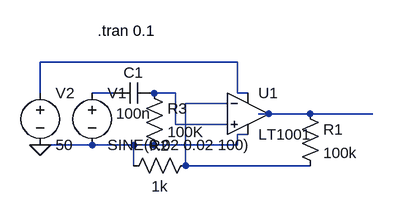
[diagram p0: schematic Draft54.asc]
Draft54.asc, the LTspice schematic file:
Version 4
SHEET 1 880 680
WIRE 528 192 224 192
WIRE 224 240 224 192
WIRE 336 240 304 240
WIRE 432 240 400 240
WIRE 528 240 528 192
WIRE 544 240 528 240
WIRE 512 256 448 256
WIRE 576 272 560 272
WIRE 640 272 576 272
WIRE 736 272 640 272
WIRE 432 288 432 240
WIRE 512 288 432 288
WIRE 544 304 528 304
WIRE 304 320 224 320
WIRE 368 320 304 320
WIRE 400 320 368 320
WIRE 528 320 528 304
WIRE 528 320 400 320
WIRE 368 352 368 320
WIRE 448 352 448 256
WIRE 640 352 448 352
FLAG 224 320 0
SYMBOL voltage 304 224 R0
SYMATTR InstName V1
SYMATTR Value SINE(0.02 0.02 100)
SYMBOL voltage 224 224 R0
SYMATTR InstName V2
SYMATTR Value 50
SYMBOL res 624 256 R0
SYMATTR InstName R1
SYMATTR Value 100k
SYMBOL res 464 336 R90
WINDOW 0 0 56 VBottom 2
WINDOW 3 32 56 VTop 2
SYMATTR InstName R2
SYMATTR Value 1k
SYMBOL Opamps/LT1001 544 208 R0
SYMATTR InstName U1
SYMBOL cap 400 224 R90
WINDOW 0 0 32 VBottom 2
WINDOW 3 32 32 VTop 2
SYMATTR InstName C1
SYMATTR Value 100n
SYMBOL res 384 224 R0
SYMATTR InstName R3
SYMATTR Value 100K
TEXT 312 144 Left 2 !.tran 0.1

The netlist it stands for:
* Draft54.asc
V1 N002 0 SINE(0.02 0.02 100)
V2 N001 0 50
R1 N005 N004 100k
R2 N004 0 1k
XU1 N003 N004 N001 0 N005 LT1001  ; pins In+ In- V+ V- OUT
C1 N003 N002 100n
R3 N003 0 100K
.tran 0.1
.lib LTC.lib
.backanno
.end